# EAGLE design binarygame-r1.1 (EAGLE 5.12)
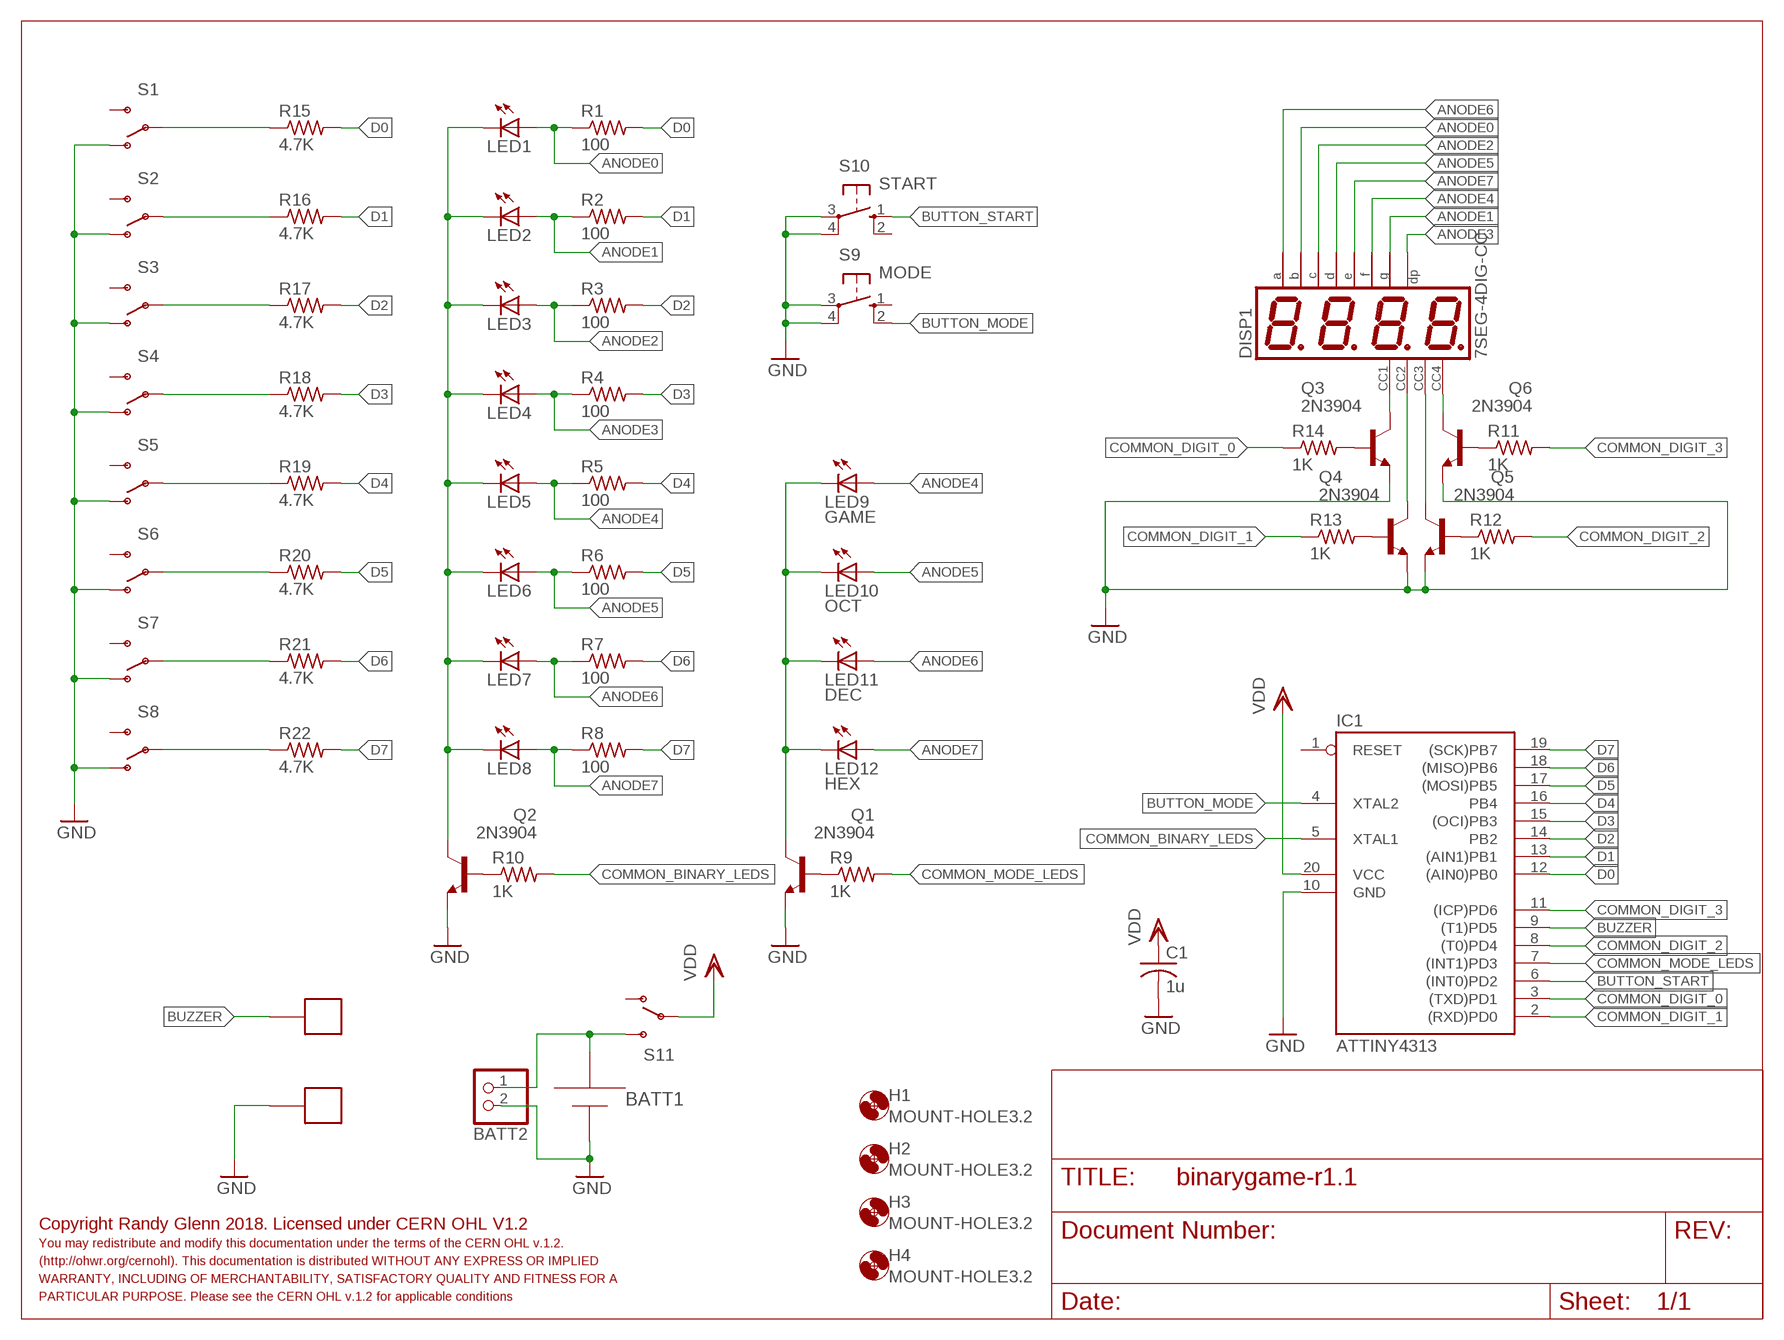
[diagram p0: schematic, sheet 1]

## Parts
BATT1  BC2AAAPC-CHINA  [BC2AAAPC-CHINA]
BATT2  JST_2PIN-THM  [JST-PH-2-THM]
C1  1u  C-US025-025X050  [C025-025X050]
DISP1  7SEG-4DIG-CC  [7SEG-0.36-4]
H1  MOUNT-HOLE3.2  [3,2]
H2  MOUNT-HOLE3.2  [3,2]
H3  MOUNT-HOLE3.2  [3,2]
H4  MOUNT-HOLE3.2  [3,2]
IC1  ATTINY4313  AT90S2313P  [DIL20]
LED1  LED3MM  [LED3MM]
LED2  LED3MM  [LED3MM]
LED3  LED3MM  [LED3MM]
LED4  LED3MM  [LED3MM]
LED5  LED3MM  [LED3MM]
LED6  LED3MM  [LED3MM]
LED7  LED3MM  [LED3MM]
LED8  LED3MM  [LED3MM]
LED9  GAME  LED3MM  [LED3MM]
LED10  OCT  LED3MM  [LED3MM]
LED11  DEC  LED3MM  [LED3MM]
LED12  HEX  LED3MM  [LED3MM]
Q1  2N3904  [TO92]
Q2  2N3904  [TO92]
Q3  2N3904  [TO92]
Q4  2N3904  [TO92]
Q5  2N3904  [TO92]
Q6  2N3904  [TO92]
R1  100  R-US_0207/10  [0207/10]
R2  100  R-US_0207/10  [0207/10]
R3  100  R-US_0207/10  [0207/10]
R4  100  R-US_0207/10  [0207/10]
R5  100  R-US_0207/10  [0207/10]
R6  100  R-US_0207/10  [0207/10]
R7  100  R-US_0207/10  [0207/10]
R8  100  R-US_0207/10  [0207/10]
R9  1K  R-US_0207/10  [0207/10]
R10  1K  R-US_0207/10  [0207/10]
R11  1K  R-US_0207/10  [0207/10]
R12  1K  R-US_0207/10  [0207/10]
R13  1K  R-US_0207/10  [0207/10]
R14  1K  R-US_0207/10  [0207/10]
R15  4.7K  R-US_0207/10  [0207/10]
R16  4.7K  R-US_0207/10  [0207/10]
R17  4.7K  R-US_0207/10  [0207/10]
R18  4.7K  R-US_0207/10  [0207/10]
R19  4.7K  R-US_0207/10  [0207/10]
R20  4.7K  R-US_0207/10  [0207/10]
R21  4.7K  R-US_0207/10  [0207/10]
R22  4.7K  R-US_0207/10  [0207/10]
S1  SWITCH-SPSTPTH  [SWITCH-SPDT]
S2  SWITCH-SPSTPTH  [SWITCH-SPDT]
S3  SWITCH-SPSTPTH  [SWITCH-SPDT]
S4  SWITCH-SPSTPTH  [SWITCH-SPDT]
S5  SWITCH-SPSTPTH  [SWITCH-SPDT]
S6  SWITCH-SPSTPTH  [SWITCH-SPDT]
S7  SWITCH-SPSTPTH  [SWITCH-SPDT]
S8  SWITCH-SPSTPTH  [SWITCH-SPDT]
S9  MODE  10-XX  [B3F-10XX]
S10  START  10-XX  [B3F-10XX]
S11  SWITCH-SPSTPTH  [SWITCH-SPDT]
X1  PAD-2X4  [PAD-2X4]
X2  PAD-2X4  [PAD-2X4]

## Nets
ANODE0: DISP1.7(B) LED1.A R1.1
ANODE1: DISP1.5(G) LED2.A R2.1
ANODE2: DISP1.4(C) LED3.A R3.1
ANODE3: DISP1.3(DP) LED4.A R4.1
ANODE4: DISP1.10(F) LED5.A LED9.A R5.1
ANODE5: DISP1.2(D) LED6.A LED10.A R6.1
ANODE6: DISP1.11(A) LED7.A LED11.A R7.1
ANODE7: DISP1.1(E) LED8.A LED12.A R8.1
BUTTON_MODE: IC1.4(XTAL2) S9.2(S1)
BUTTON_START: IC1.6((INT0)PD2) S10.1(S)
BUZZER: IC1.9((T1)PD5) X1.P$1
COMMON_BINARY_LEDS: IC1.5(XTAL1) R10.2
COMMON_DIGIT_0: IC1.3((TXD)PD1) R14.1
COMMON_DIGIT_1: IC1.2((RXD)PD0) R13.1
COMMON_DIGIT_2: IC1.8((T0)PD4) R12.2
COMMON_DIGIT_3: IC1.11((ICP)PD6) R11.2
COMMON_MODE_LEDS: IC1.7((INT1)PD3) R9.2
D0: IC1.12((AIN0)PB0) R1.2 R15.2
D1: IC1.13((AIN1)PB1) R2.2 R16.2
D2: IC1.14(PB2) R3.2 R17.2
D3: IC1.15((OCI)PB3) R4.2 R18.2
D4: IC1.16(PB4) R5.2 R19.2
D5: IC1.17((MOSI)PB5) R6.2 R20.2
D6: IC1.18((MISO)PB6) R7.2 R21.2
D7: IC1.19((SCK)PB7) R8.2 R22.2
GND: BATT1.- BATT2.2 C1.2 IC1.10(GND) Q1.3(E) Q2.3(E) Q3.3(E) Q4.3(E) Q5.3(E) Q6.3(E) S1.1(O) S2.1(O) S3.1(O) S4.1(O) S5.1(O) S6.1(O) S7.1(O) S8.1(O) S9.3(P) S9.4(P1) S10.3(P) S10.4(P1) X2.P$1
N$1: R15.1 S1.2(P)
N$2: R16.1 S2.2(P)
N$3: R17.1 S3.2(P)
N$4: R18.1 S4.2(P)
N$5: R19.1 S5.2(P)
N$6: R20.1 S6.2(P)
N$7: R21.1 S7.2(P)
N$8: R22.1 S8.2(P)
N$10: LED1.K(C) LED2.K(C) LED3.K(C) LED4.K(C) LED5.K(C) LED6.K(C) LED7.K(C) LED8.K(C) Q2.1(C)
N$11: DISP1.12(CC1) Q3.1(C)
N$12: DISP1.9(CC2) Q4.1(C)
N$13: DISP1.8(CC3) Q5.1(C)
N$14: DISP1.6(CC4) Q6.1(C)
N$16: Q2.2(B) R10.1
N$17: Q6.2(B) R11.1
N$18: Q5.2(B) R12.1
N$19: Q4.2(B) R13.2
N$20: Q3.2(B) R14.2
N$21: Q1.2(B) R9.1
N$22: LED9.K(C) LED10.K(C) LED11.K(C) LED12.K(C) Q1.1(C)
N$23: BATT1.+ BATT2.1 S11.3(S)
VDD: C1.1 IC1.20(VCC) S11.2(P)
Unconnected: IC1.1(RESET) S1.3(S) S2.3(S) S3.3(S) S4.3(S) S5.3(S) S6.3(S) S7.3(S) S8.3(S) S9.1(S) S10.2(S1) S11.1(O)

## Notes on the sheet
- Copyright Randy Glenn 2018. Licensed under CERN OHL V1.2
- You may redistribute and modify this documentation under the terms of the CERN OHL v.1.2.
- (http://ohwr.org/cernohl). This documentation is distributed WITHOUT ANY EXPRESS OR IMPLIED
- WARRANTY, INCLUDING OF MERCHANTABILITY, SATISFACTORY QUALITY AND FITNESS FOR A
- PARTICULAR PURPOSE. Please see the CERN OHL v.1.2 for applicable conditions

## Library data of the parts
BATT1 = rbg-mpd-battholder:BC2AAAPC-CHINA
BATT2 = adafruit:JST_2PIN: JST 2-Pin Connectors of various flavors SMT-RA (S2B-PH-SM4) 4UConnector #17311 SMT (B2B-PH-SM4) THM-RA (S2B-PH) THM (B2B-PH)
C1 = rcl:C-US: CAPACITOR, American symbol
DISP1 = led-display-4digit:7SEG-4DIG-CC
H1-H4 = holes:MOUNT-HOLE: MOUNTING HOLE with drill center marker
IC1 = atmel-1:AT90S2313: MICROCONTROLLER 2 Kbytes FLASH 128 bytes SRAM 128 bytes EEPROM UART
LED1-LED12 = led:LED: LED OSRAM: - CHIPLED LG R971, LG N971, LY N971, LG Q971, LY Q971, LO R971, LY R971 LH N974, LH R974 LS Q976, LO Q976, LY Q976 LO Q996 - Hyper CHIPLED LW Q18S LB Q993, LB Q99A, LB R99A - SideLED LS A670, LO A670, LY A670, LG A670, LP A670 LB A673, LV A673, LT A673, LW A673 LH A674 LY A675 LS A676, LA A676, LO A676, LY A676, LW A676 LS A679, LY A679, LG A679 - Hyper Micro SIDELED® LS Y876, LA Y876, LO Y876, LY Y876 LT Y87S - SmartLED LW L88C, LW L88S LB L89C, LB L89S, LG L890 LS L89K, LO L89K, LY L89K LS L896, LA L896, LO L896, LY L896 - TOPLED LS T670, LO T670, LY T670, LG T670, LP T670 LSG T670, LSP T670, LSY T670, LOP T670, LYG T670 LG T671, LOG T671, LSG T671 LB T673, LV T673, LT T673, LW T673 LH T674 LS T676, LA T676, LO T676, LY T676, LB T676, LH T676, LSB T676, LW T676 LB T67C, LV T67C, LT T67C, LS T67K, LO T67K, LY T67K, LW E67C LS E67B, LA E67B, LO E67B, LY E67B, LB E67C, LV E67C, LT E67C LW T67C LS T679, LY T679, LG T679 LS T770, LO T770, LY T770, LG T770, LP T770 LB T773, LV T773, LT T773, LW T773 LH T774 LS E675, LA E675, LY E675, LS T675 LS T776, LA T776, LO T776, LY T776, LB T776 LHGB T686 LT T68C, LB T68C - Hyper Mini TOPLED® LB M676 - Mini TOPLED Santana® LG M470 LS M47K, LO M47K, LY M47K Source: http://www.osram.convergy.de LUXEON: - LUMILED® LXK2-PW12-R00, LXK2-PW12-S00, LXK2-PW14-U00, LXK2-PW14-V00 LXK2-PM12-R00, LXK2-PM12-S00, LXK2-PM14-U00 LXK2-PE12-Q00, LXK2-PE12-R00, LXK2-PE12-S00, LXK2-PE14-T00, LXK2-PE14-U00 LXK2-PB12-K00, LXK2-PB12-L00, LXK2-PB12-M00, LXK2-PB14-N00, LXK2-PB14-P00, LXK2-PB14-Q00 LXK2-PR12-L00, LXK2-PR12-M00, LXK2-PR14-Q00, LXK2-PR14-R00 LXK2-PD12-Q00, LXK2-PD12-R00, LXK2-PD12-S00 LXK2-PH12-R00, LXK2-PH12-S00 LXK2-PL12-P00, LXK2-PL12-Q00, LXK2-PL12-R00 Source: www.luxeon.com KINGBRIGHT: KA-3528ASYC Source: www.kingbright.com
Q1-Q6 = transistor-npn:2N3904: NPN Transistor
R1-R22 = rcl:R-US_: RESISTOR, American symbol
S1-S8 S11 = SparkFun:SWITCH-SPST: SPST Switch Simple slide switch. Spark Fun Electronics SKU : COM-00102
S9 S10 = rbg-generic-tact-switch:10-XX: OMRON SWITCH
X1 X2 = rbg-generic-pads:PAD

## Board
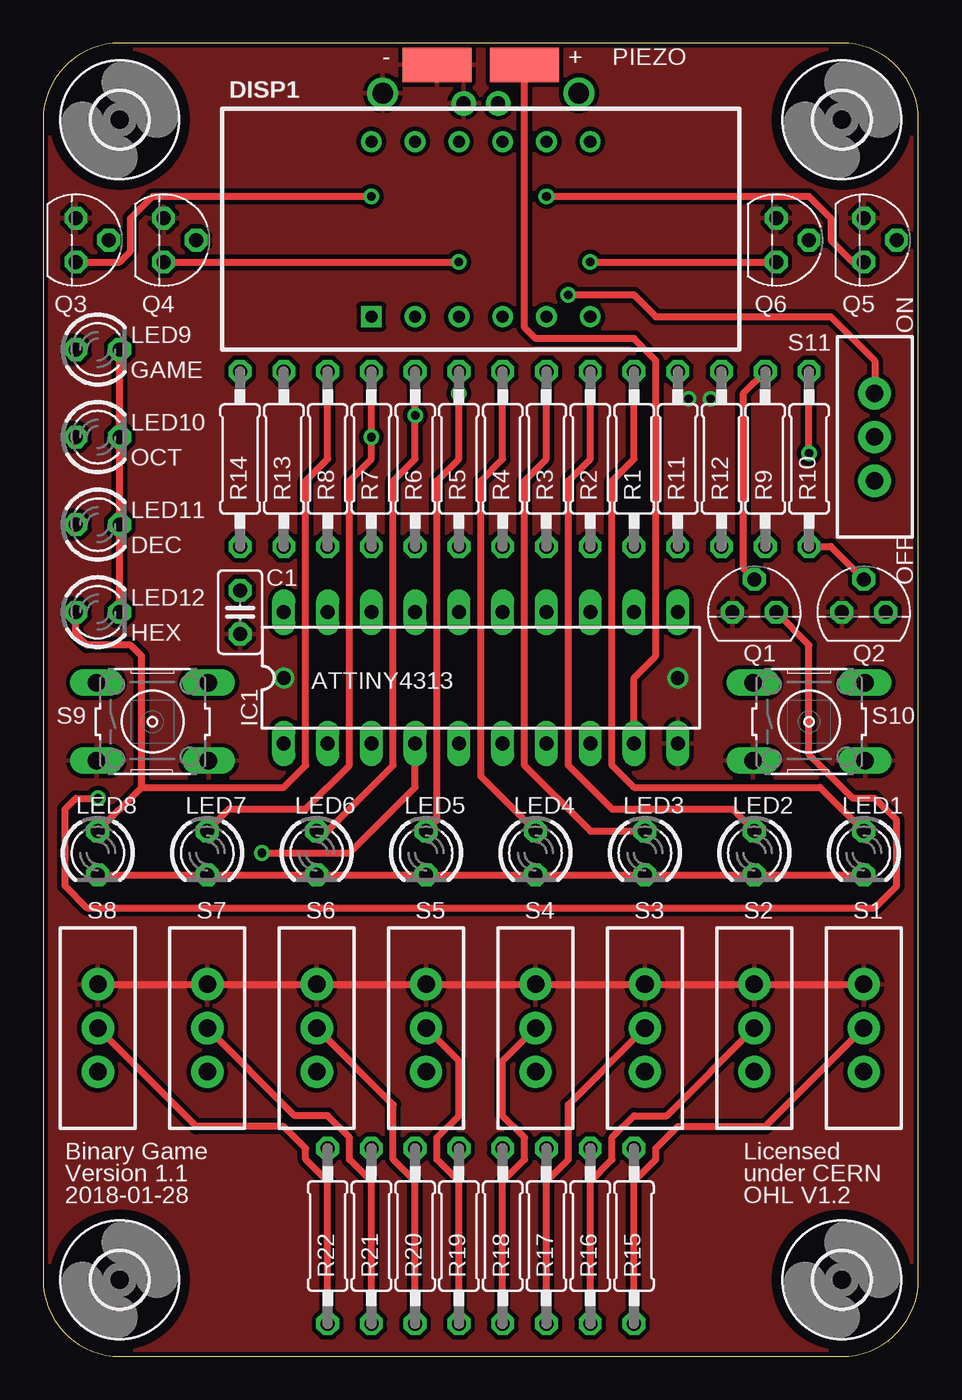
[diagram p1: board, top side]
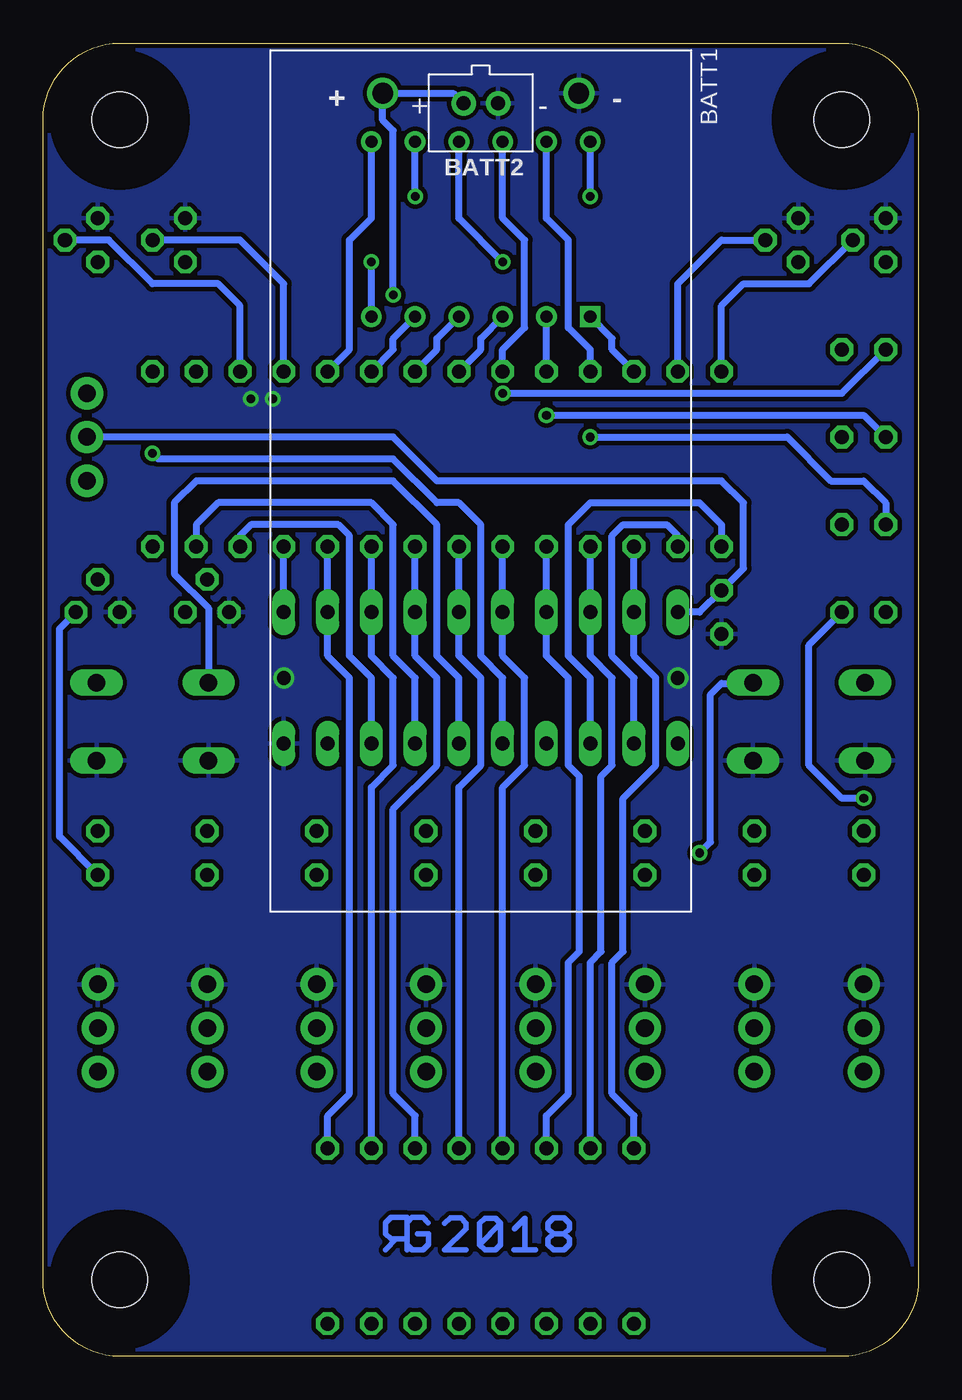
[diagram p2: board, bottom side, seen from below]

Size 50.8 x 76.2 mm. Coordinates in mm from the lower left corner, seen from the top.
Outline: 0,4.45 arc90 4.45,0 46.35,0 arc90 50.8,4.45 50.8,71.75 arc90 46.35,76.2 4.45,76.2 arc90 0,71.75 0,4.45
Copper layers (1*16): Top 0.035mm / dielectric 1.5mm / Bottom 0.035mm
Design rules "default *": minimum track width 10mil, minimum drill 0.4mm, track to track 10mil, track to pad 10mil, pad to pad 10mil, via to via 10mil, smd to smd 10mil, copper to edge 10mil, drill to drill 8mil, minimum pad ring 10mil, minimum via ring 8mil, stop-mask expansion 4mil, vias tented up to drill 20mil, thermal gap 10mil

### Footprints (pad centres in the part's own frame; a part is rotated, then mirrored left to right if it is on the bottom)
BC2AAAPC-CHINA = drill 1.2 round: + -22.49,-5.69; - -22.49,5.69
JST-PH-2-THM = drill 0.8 pad 1.422 round: 1 1,0; 2 -1,0
C025-025X050 = drill 0.813 octagon: 1 -1.27,0; 2 1.27,0
7SEG-0.36-4 = drill 0.7 square: 1 -6.35,-5.08 | drill 0.7 round: 2 -3.81,-5.08; 3 -1.27,-5.08; 4 1.27,-5.08; 5 3.81,-5.08; 6 6.35,-5.08; 7 6.35,5.08; 8 3.81,5.08; 9 1.27,5.08; 10 -1.27,5.08; 11 -3.81,5.08; 12 -6.35,5.08
3,2 = hole 3.2: 0,0
DIL20 = drill 0.813 long: 1 -11.43,-3.81; 2 -8.89,-3.81; 3 -6.35,-3.81; 4 -3.81,-3.81; 5 -1.27,-3.81; 6 1.27,-3.81; 7 3.81,-3.81; 8 6.35,-3.81; 9 8.89,-3.81; 10 11.43,-3.81; 11 11.43,3.81; 12 8.89,3.81; 13 6.35,3.81; 14 3.81,3.81; 15 1.27,3.81; 16 -1.27,3.81; 17 -3.81,3.81; 18 -6.35,3.81; 19 -8.89,3.81; 20 -11.43,3.81
LED3MM = drill 0.813 octagon: A -1.27,0; K 1.27,0
TO92 = drill 0.813 octagon: 1 1.27,0; 2 0,1.905; 3 -1.27,0
0207/10 = drill 0.813 octagon: 1 -5.08,0; 2 5.08,0
SWITCH-SPDT = drill 1.016 pad 1.88 round: 1 0,2.54; 2 0,0; 3 0,-2.54
B3F-10XX = drill 1.016 long: 1 -3.251,2.261; 2 3.251,2.261; 3 -3.251,-2.261; 4 3.251,-2.261
PAD-2X4 = smd 4 x 2: P$1 0,0

### Placement (x,y rotation side)
BATT1  25.4,50.8 270 bottom
BATT2  25.4,72.71 180 bottom
C1  11.43,43.18 270 top
DISP1  25.4,65.41 0 top
H1  46.35,4.45 0 top
H2  4.45,4.45 0 top
H3  4.45,71.75 0 top
H4  46.35,71.75 0 top
IC1  25.4,39.37 0 top
LED1  47.62,29.21 270 top
LED2  41.27,29.21 270 top
LED3  34.92,29.21 270 top
LED4  28.57,29.21 270 top
LED5  22.23,29.21 270 top
LED6  15.88,29.21 270 top
LED7  9.53,29.21 270 top
LED8  3.17,29.21 270 top
LED9  3.17,58.42 0 top
LED10  3.17,53.34 0 top
LED11  3.17,48.26 0 top
LED12  3.17,43.18 0 top
Q1  41.27,43.18 0 top
Q2  47.62,43.18 0 top
Q3  1.91,64.77 270 top
Q4  6.99,64.77 270 top
Q5  47.62,64.77 270 top
Q6  42.55,64.77 270 top
R1  34.29,52.07 270 top
R2  31.75,52.07 270 top
R3  29.21,52.07 270 top
R4  26.67,52.07 270 top
R5  24.13,52.07 270 top
R6  21.59,52.07 270 top
R7  19.05,52.07 270 top
R8  16.51,52.07 270 top
R9  41.91,52.07 270 top
R10  44.45,52.07 90 top
R11  36.83,52.07 270 top
R12  39.37,52.07 270 top
R13  13.97,52.07 90 top
R14  11.43,52.07 90 top
R15  34.29,6.99 90 top
R16  31.75,6.99 90 top
R17  29.21,6.99 90 top
R18  26.67,6.99 90 top
R19  24.13,6.99 90 top
R20  21.59,6.99 90 top
R21  19.05,6.99 90 top
R22  16.51,6.99 90 top
S1  47.62,19.05 0 top
S2  41.27,19.05 0 top
S3  34.92,19.05 0 top
S4  28.57,19.05 0 top
S5  22.23,19.05 0 top
S6  15.88,19.05 0 top
S7  9.53,19.05 0 top
S8  3.17,19.05 0 top
S9  6.35,36.83 0 top
S10  44.45,36.83 0 top
S11  48.26,53.34 180 top
U$1  [RGLOGO_SMALL_2018]  29.53,6.03 0 bottom
U$2  [OSHW_FILLX150_NOTEXT]  35.88,8.57 0 top
X1  27.94,74.93 0 top
X2  22.86,74.93 0 top

### Tracks (layer width: path | path; a pad name or v marks a point on that pad's centre or on a via)
ANODE0
  Top 0.406: R1.1 34.29,52.07 33.02,50.8 33.02,34.29 34.29,33.02 45.09,33.02 LED1.A
  Bottom 0.406: R1.1 33.02,58.42 33.02,64.77 31.75,66.04 DISP1.7
ANODE1
  Top 0.406: R2.1 31.75,52.07 30.48,50.8 30.48,34.29 33.02,31.75 40.01,31.75 LED2.A
  Bottom 0.406: R2.1 30.48,58.42 30.48,59.05 DISP1.5
ANODE2
  Top 0.406: R3.1 29.21,52.07 27.94,50.8 27.94,34.29 31.75,30.48 LED3.A
  Bottom 0.406: R3.1 27.94,58.42 27.94,59.05 DISP1.4
ANODE3
  Top 0.406: R4.1 26.67,52.07 25.4,50.8 25.4,33.66 LED4.A
  Bottom 0.406: R4.1 25.4,58.42 25.4,59.05 DISP1.3
ANODE4  (via drill 0.5)
  Top 0.406: R5.1 v24.13,55.88 24.13,52.07 22.86,50.8 22.86,31.11 LED5.A
  Bottom 0.406: R5.1 24.13,58.42 22.86,59.69 22.86,64.77 24.13,66.04 DISP1.10 | LED9.A 4.45,55.88 v24.13,55.88
ANODE5  (via drill 0.5)
  Top 0.406: R6.1 v21.59,54.61 21.59,52.07 20.32,50.8 20.32,34.29 16.51,30.48 LED6.A
  Bottom 0.406: R6.1 DISP1.2 | LED10.A 3.17,54.61 v21.59,54.61
ANODE6  (via drill 0.5)
  Top 0.406: R7.1 v19.05,53.34 19.05,52.07 17.78,50.8 17.78,34.29 15.24,31.75 10.79,31.75 LED7.A
  Bottom 0.406: R7.1 19.05,58.42 20.32,59.69 20.32,64.77 21.59,66.04 DISP1.11 | LED11.A 1.91,49.53 3.17,50.8 5.08,50.8 7.62,53.34 v19.05,53.34
ANODE7
  Top 0.406: R8.1 16.51,52.07 15.24,50.8 15.24,34.29 13.97,33.02 5.71,33.02 | LED8.A 5.71,33.02 | LED12.A 1.91,41.91 2.54,41.27 5.08,41.27 5.71,40.64 5.71,33.02
  Bottom 0.406: R8.1 17.78,58.42 17.78,59.05 DISP1.1
BUTTON_MODE  (via drill 0.5)
  Top 0.406: IC1.4 21.59,33.02 17.78,29.21 v12.7,29.21
  Bottom 0.406: v12.7,29.21 12.06,29.84 12.06,38.42 11.43,39.05 9.64,39.05 S9.2
BUTTON_START
  Bottom 0.406: IC1.6 26.67,39.37 27.94,40.64 27.94,48.26 30.48,50.8 41.91,50.8 43.18,49.53 43.18,45.4 41.2,43.42 S10.1
BUZZER
  Top 0.406: IC1.9 34.29,39.37 35.56,40.64 35.56,57.78 34.29,59.05 28.57,59.05 27.94,59.69 X1.P$1
COMMON_BINARY_LEDS  (via drill 0.5)
  Top 0.406: v44.45,52.39 R10.2
  Bottom 0.406: IC1.5 24.13,39.37 25.4,40.64 25.4,48.26 26.67,49.53 27.94,49.53 30.48,52.07 44.13,52.07 v44.45,52.39
COMMON_DIGIT_0
  Bottom 0.406: IC1.3 19.05,39.37 20.32,40.64 20.32,48.26 19.05,49.53 12.7,49.53 11.43,48.26 R14.1
COMMON_DIGIT_1
  Bottom 0.406: IC1.2 16.51,39.37 17.78,40.64 17.78,47.62 17.14,48.26 14.61,48.26 13.97,47.62 R13.1
COMMON_DIGIT_2
  Bottom 0.406: IC1.8 31.75,39.37 33.02,40.64 33.02,47.62 33.66,48.26 38.73,48.26 39.37,47.62 R12.2
COMMON_DIGIT_3
  Bottom 0.406: IC1.11 R11.2
COMMON_MODE_LEDS
  Bottom 0.406: R9.2 41.91,48.26 40.64,49.53 31.75,49.53 30.48,48.26 30.48,40.64 29.21,39.37 IC1.7
D0
  Bottom 0.406: R1.2 IC1.12 34.29,40.64 33.02,39.37 33.02,15.24 34.29,13.97 R15.2
D1
  Bottom 0.406: R2.2 IC1.13 31.75,40.64 30.48,39.37 30.48,34.29 31.75,33.02 R16.2
D2
  Bottom 0.406: R3.2 IC1.14 29.21,40.64 27.94,39.37 27.94,34.29 30.48,31.75 30.48,15.24 29.21,13.97 R17.2
D3
  Bottom 0.406: R4.2 IC1.15 26.67,40.64 25.4,39.37 25.4,34.29 26.67,33.02 R18.2
D4
  Bottom 0.406: R5.2 IC1.16 24.13,40.64 22.86,39.37 22.86,34.29 24.13,33.02 R19.2
D5
  Bottom 0.406: R6.2 IC1.17 21.59,40.64 20.32,39.37 20.32,34.29 19.68,33.66 19.68,23.5 20.32,22.86 20.32,15.24 21.59,13.97 R20.2
D6
  Bottom 0.406: R7.2 IC1.18 19.05,40.64 17.78,39.37 17.78,34.29 18.41,33.66 18.41,23.5 19.05,22.86 R21.2
D7
  Bottom 0.406: R8.2 IC1.19 16.51,40.64 15.24,39.37 15.24,34.29 17.14,32.38 17.14,23.5 17.78,22.86 17.78,15.24 16.51,13.97 R22.2
GND  (via drill 0.5, 0.8)
  Top 0.406: S1.1 S2.1 S3.1 S4.1 S5.1 S6.1 S7.1 S8.1
  other vias: 37.47,55.56 38.73,55.56 13.97,39.37 36.83,39.37
  pour Top: 0,0 50.8,0 50.8,76.2 0,76.2
  pour Bottom: 0,0 50.8,0 50.8,76.2 0,76.2
N$1
  Top 0.406: S1.2 41.91,13.34 36.83,13.34 35.56,12.06 35.56,11.43 34.29,10.16 R15.1
N$2
  Top 0.406: S2.2 36.2,13.97 34.29,13.97 33.02,12.7 33.02,11.43 31.75,10.16 R16.1
N$3
  Top 0.406: S3.2 30.48,14.61 30.48,11.43 29.21,10.16 R17.1
N$4
  Top 0.406: S4.2 26.67,17.14 26.67,13.97 27.94,12.7 27.94,11.43 26.67,10.16 R18.1
N$5
  Top 0.406: S5.2 24.13,17.14 24.13,13.97 22.86,12.7 22.86,11.43 24.13,10.16 R19.1
N$6
  Top 0.406: S6.2 20.32,14.61 20.32,11.43 21.59,10.16 R20.1
N$7
  Top 0.406: S7.2 14.61,13.97 16.51,13.97 17.78,12.7 17.78,11.43 19.05,10.16 R21.1
N$8
  Top 0.406: S8.2 8.89,13.34 13.97,13.34 15.24,12.06 15.24,11.43 16.51,10.16 R22.1
N$10
  Top 0.406: LED8.K LED7.K LED6.K LED5.K LED4.K LED3.K LED2.K LED1.K
  Bottom 0.406: LED1.K 49.85,30.16 49.85,42.23 Q2.1
N$11  (via drill 0.5)
  Top 0.406: Q3.1 4.45,63.5 5.08,64.14 5.08,66.04 6.35,67.31 v19.05,67.31
  Bottom 0.406: v19.05,67.31 DISP1.12
N$12  (via drill 0.5)
  Top 0.406: Q4.1 v24.13,63.5
  Bottom 0.406: DISP1.9 26.67,66.04 v24.13,63.5
N$13  (via drill 0.5)
  Top 0.406: Q5.1 46.99,63.5 45.72,64.77 45.72,66.04 44.45,67.31 v29.21,67.31
  Bottom 0.406: v29.21,67.31 DISP1.8
N$14  (via drill 0.5)
  Top 0.406: v31.75,63.5 Q6.1
  Bottom 0.406: DISP1.6 v31.75,63.5
N$16
  Top 0.406: R10.1 45.72,46.99 Q2.2
N$17
  Bottom 0.406: R11.1 36.83,62.23 39.37,64.77 Q6.2
N$18
  Bottom 0.406: R12.1 39.37,60.96 40.64,62.23 44.45,62.23 46.99,64.77 Q5.2
N$19
  Bottom 0.406: R13.2 13.97,62.23 11.43,64.77 Q4.2
N$20
  Bottom 0.406: R14.2 11.43,60.96 10.16,62.23 6.35,62.23 Q3.2
N$21
  Top 0.406: R9.1 40.64,55.88 40.64,45.72 Q1.2
N$22  (via drill 0.5)
  Top 0.406: LED12.K LED11.K LED10.K LED9.K | v3.17,32.38 1.91,32.38 1.27,31.75 1.27,27.3 2.54,26.04 48.26,26.04 49.53,27.3 49.53,31.11 48.26,32.38 46.99,32.38 44.45,34.92 44.45,41.27 Q1.1
  Bottom 0.406: LED12.K 6.35,41.27 6.35,34.29 4.45,32.38 v3.17,32.38
N$23  (via drill 0.5)
  Top 0.406: S11.3 48.26,57.78 45.72,60.33 35.56,60.33 34.29,61.59 v30.48,61.59
  Bottom 0.406: v30.48,61.59 30.48,71.12 31.09,71.73 BATT1.+ 26.98,73.29 BATT2.1
VDD
  Bottom 0.406: S11.2 30.48,53.34 27.94,50.8 11.43,50.8 10.16,49.53 10.16,45.72 C1.1 12.7,43.18 IC1.20

### Text on the board
tNames: - | + | PIEZO | ON | OFF | Binary Game | Licensed | Version 1.1 | under CERN | 2018-01-28 | OHL V1.2